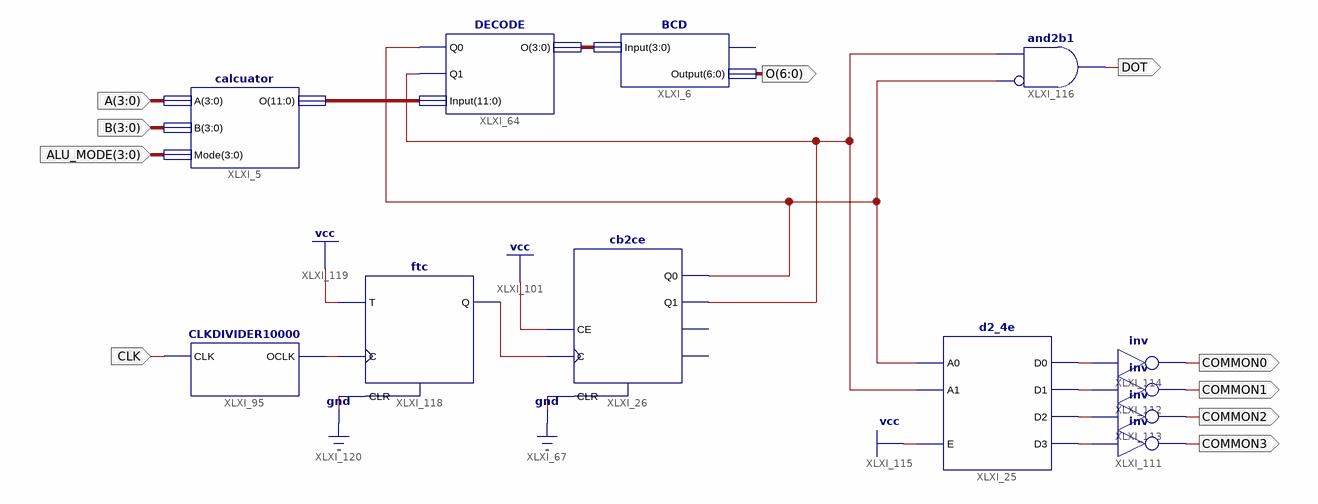
[diagram p0: schematic sheet 1]
// Xilinx ISE schematic main.sch (spartan6) as structural Verilog: 12 symbols, 10 ports
module main (
  input  [3:0] ALU_MODE,
  input  [3:0] B,
  input  [3:0] A,
  input  CLK,
  output [6:0] O,
  output COMMON0,
  output COMMON1,
  output COMMON2,
  output COMMON3,
  output DOT
);

  wire XLXN_84, XLXN_85, XLXN_86, XLXN_87, XLXN_227, XLXN_228, XLXN_231, XLXN_233;
  wire [3:0] XLXN_134;
  wire [11:0] XLXN_138;

  cb2ce XLXI_26 (.C(XLXN_233), .CE(1'b1), .CLR(1'b0), .Q0(XLXN_227), .Q1(XLXN_228));  // open: CEO, TC
  d2_4e XLXI_25 (.A0(XLXN_227), .A1(XLXN_228), .E(1'b1), .D0(XLXN_84), .D1(XLXN_85), .D2(XLXN_86), .D3(XLXN_87));
  BCD XLXI_6 (.Input(XLXN_134), .Output(O));  // open: Dot
  DECODE XLXI_64 (.Q0(XLXN_227), .Q1(XLXN_228), .Input(XLXN_138), .O(XLXN_134));
  calcuator XLXI_5 (.A(A), .B(B), .Mode(ALU_MODE), .O(XLXN_138));
  not XLXI_111 (COMMON3, XLXN_87);
  not XLXI_112 (COMMON1, XLXN_85);
  not XLXI_113 (COMMON2, XLXN_86);
  not XLXI_114 (COMMON0, XLXN_84);
  and XLXI_116 (DOT, ~XLXN_227, XLXN_228);  // and2b1
  CLKDIVIDER10000 XLXI_95 (.CLK(CLK), .OCLK(XLXN_231));
  ftc XLXI_118 (.C(XLXN_231), .CLR(1'b0), .T(1'b1), .Q(XLXN_233));
endmodule
